# EAGLE schematic Sistema anti-allagamento_ELETTRONICA (EAGLE 7.4.0)
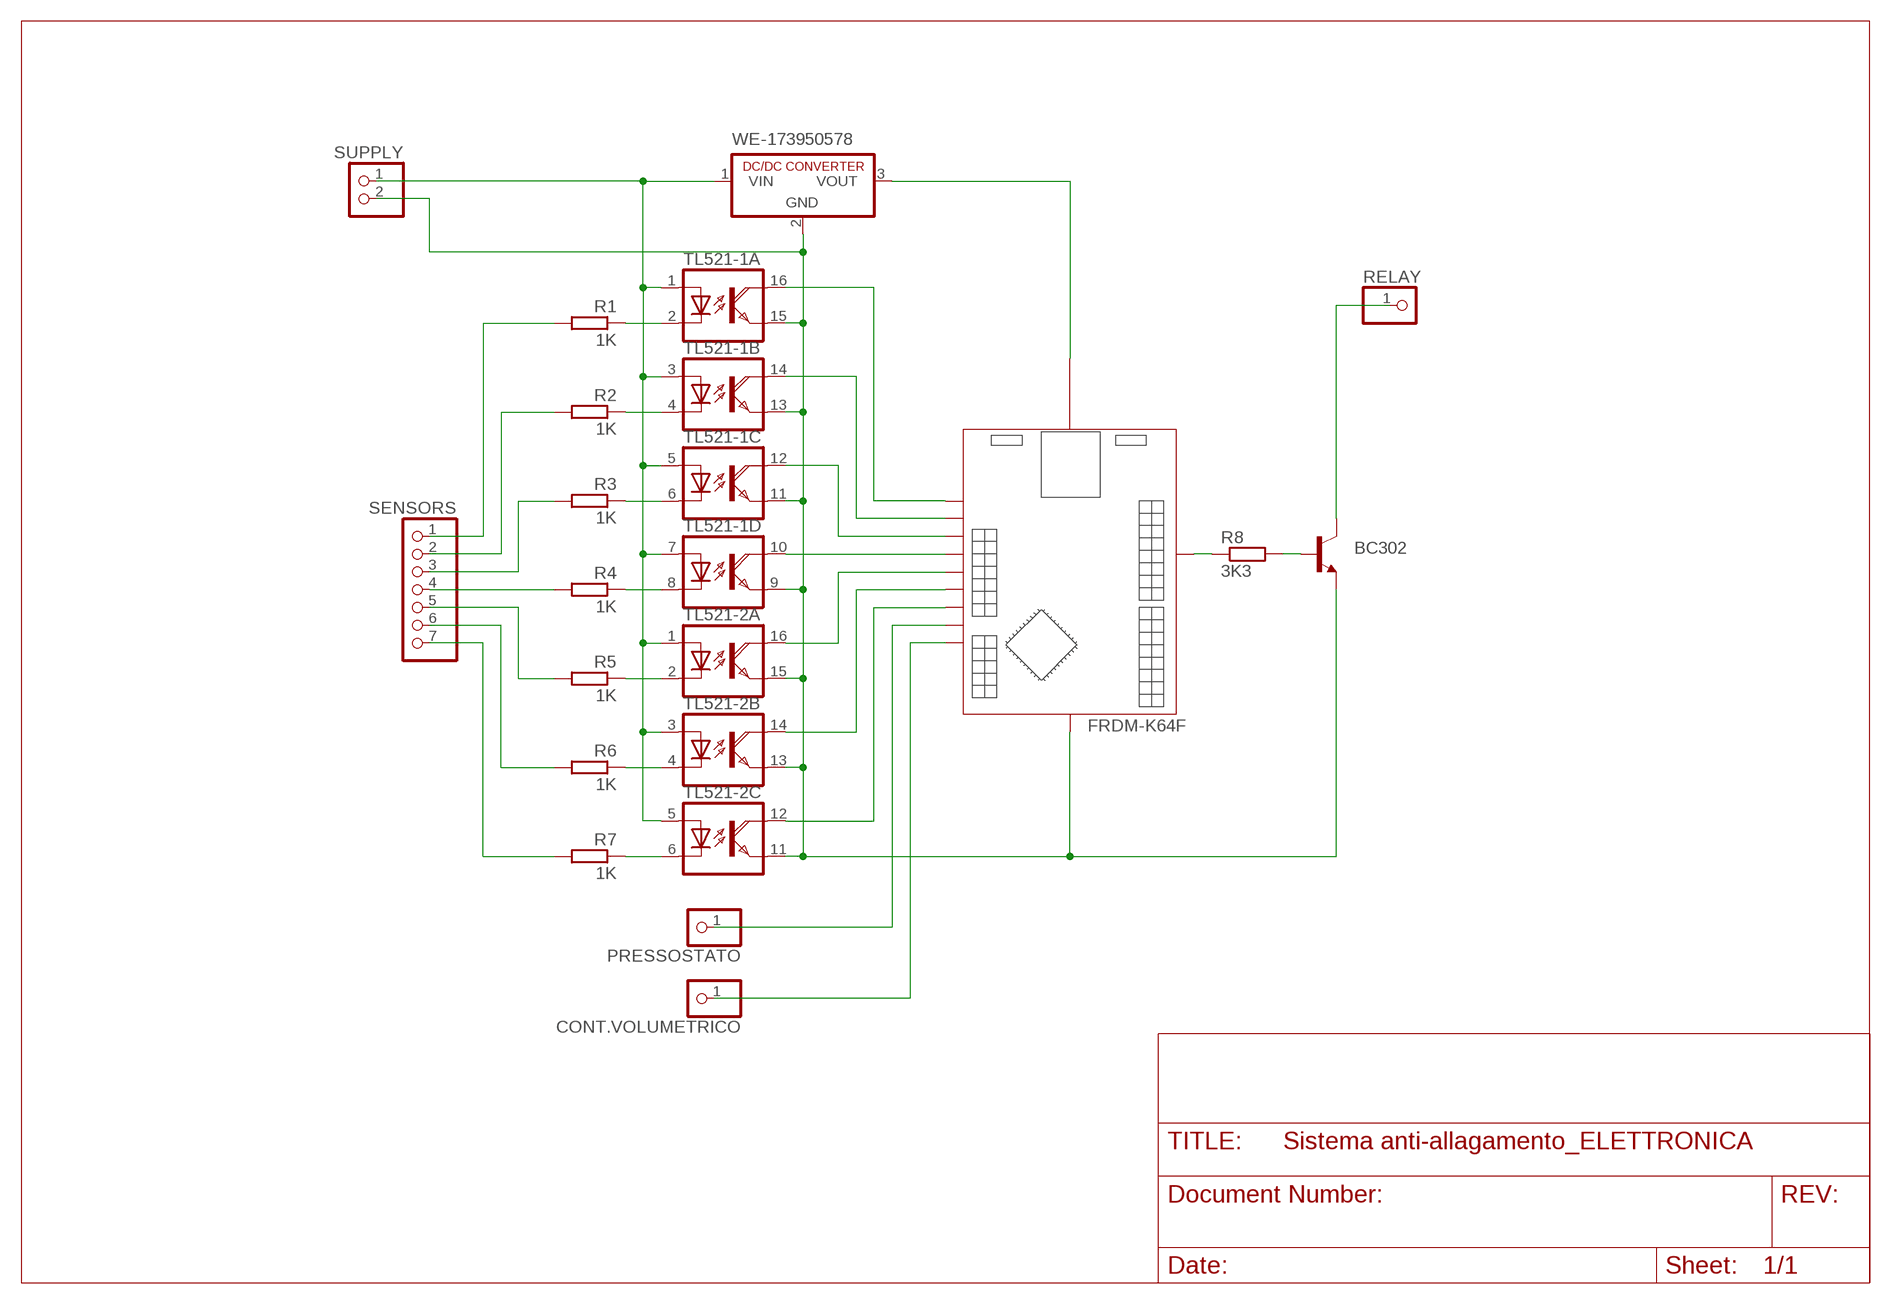
[diagram p0: schematic, sheet 1]

## Parts
BC302  BFY50  [TO39]
CONT.VOLUMETRICO  PINHD-1X1  [1X01]
PRESSOSTATO  PINHD-1X1  [1X01]
R1  1K  R-EU_0207/7  [0207/7]
R2  1K  R-EU_0207/7  [0207/7]
R3  1K  R-EU_0207/7  [0207/7]
R4  1K  R-EU_0207/7  [0207/7]
R5  1K  R-EU_0207/7  [0207/7]
R6  1K  R-EU_0207/7  [0207/7]
R7  1K  R-EU_0207/7  [0207/7]
R8  3K3  R-EU_0204/7  [0204/7]
RELAY  PINHD-1X1  [1X01]
SENSORS  PINHD-1X7  [1X07]
SUPPLY  PINHD-1X2  [1X02]
TL521-1  TIL199  [DIL16]
TL521-2  TIL199  [DIL16]
WE-173950578  R-78C1.8-1.0  [SIP3]

## Nets
N$1: TL521-1.16(A:COL)
N$2: TL521-2.12(C:COL)
N$3: TL521-2.14(B:COL)
N$4: TL521-2.16(A:COL)
N$5: TL521-1.10(D:COL)
N$6: TL521-1.12(C:COL)
N$7: TL521-1.14(B:COL)
N$8: R1.2 SENSORS.1
N$9: R4.2 SENSORS.4
N$10: R1.1 TL521-1.2(A:C)
N$11: R3.1 TL521-1.6(C:C)
N$12: R4.1 TL521-1.8(D:C)
N$13: R5.1 TL521-2.2(A:C)
N$14: R6.1 TL521-2.4(B:C)
N$15: R7.1 TL521-2.6(C:C)
N$17: BC302.1(E) SUPPLY.2 TL521-1.9(D:EMI) TL521-1.11(C:EMI) TL521-1.13(B:EMI) TL521-1.15(A:EMI) TL521-2.11(C:EMI) TL521-2.13(B:EMI) TL521-2.15(A:EMI) WE-173950578.2(GND)
N$18: R2.2 SENSORS.2
N$19: R3.2 SENSORS.3
N$20: SUPPLY.1 TL521-1.1(A:A) TL521-1.3(B:A) TL521-1.5(C:A) TL521-1.7(D:A) TL521-2.1(A:A) TL521-2.3(B:A) TL521-2.5(C:A) WE-173950578.1(VIN)
N$21: R5.2 SENSORS.5
N$22: R6.2 SENSORS.6
N$23: R7.2 SENSORS.7
N$24: PRESSOSTATO.1
N$25: CONT.VOLUMETRICO.1
N$26: WE-173950578.3(VOUT)
N$27: BC302.2(B) R8.2
N$28: R8.1
N$29: BC302.3(C) RELAY.1
N$30: R2.1 TL521-1.4(B:C)
Unconnected: TL521-2.7(D:A) TL521-2.8(D:C) TL521-2.9(D:EMI) TL521-2.10(D:COL)

## Notes on the sheet
- FRDM-K64F

## Library data of the parts
BC302 = transistor-npn:BFY50*: NPN Transistor
CONT.VOLUMETRICO PRESSOSTATO RELAY = pinhead:PINHD-1X1: PIN HEADER
R1-R8 = rcl:R-EU_: RESISTOR, European symbol
SENSORS = pinhead:PINHD-1X7: PIN HEADER
SUPPLY = pinhead:PINHD-1X2: PIN HEADER
TL521-1 TL521-2 = optocoupler:TIL199: TEXAS INSTRUMENTS OPTO COUPLER; MPN: TIL 199; OC_FARNELL: 1683370; OC_NEWARK: 05R6483
WE-173950578 = dc-dc-converter:R-78C*-1.0: INNOLINE DC/DC-Converter 1.0 AMP SIP3 Single Output Source: Data sheet <http://www.mikrocontroller.net/attachment/150645/157764-da-01-en-DC_DC_WANDLER_R_78C5_0_1_0.pdf>